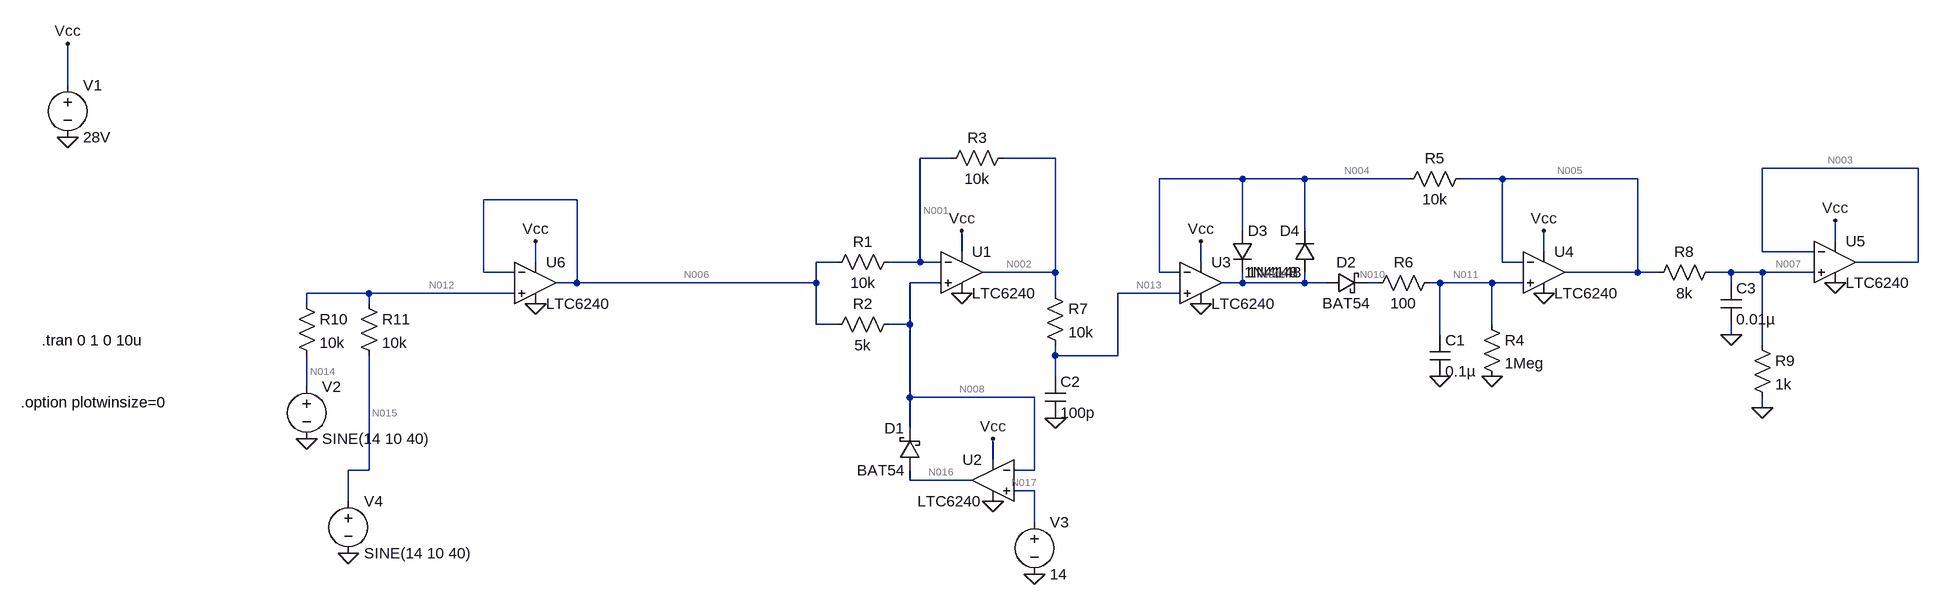
[diagram p0: schematic peak detector 2.asc]
peak detector 2.asc, the LTspice schematic file:
Version 4
SHEET 1 2260 680
WIRE -672 -160 -672 -224
WIRE 688 -48 640 -48
WIRE 848 -48 768 -48
WIRE 2176 -32 1936 -32
WIRE 1136 -16 1008 -16
WIRE 1232 -16 1136 -16
WIRE 1392 -16 1232 -16
WIRE 1536 -16 1472 -16
WIRE 1744 -16 1536 -16
WIRE 112 16 -32 16
WIRE 1136 64 1136 -16
WIRE 1232 64 1232 -16
WIRE 2048 80 2048 48
WIRE 704 96 704 64
WIRE 1600 96 1600 64
WIRE 1936 96 1936 -32
WIRE 2016 96 1936 96
WIRE 48 112 48 80
WIRE 512 112 480 112
WIRE 640 112 640 -48
WIRE 640 112 592 112
WIRE 672 112 640 112
WIRE 1072 112 1072 80
WIRE 1536 112 1536 -16
WIRE 1568 112 1536 112
WIRE 2176 112 2176 -32
WIRE 2176 112 2080 112
WIRE -32 128 -32 16
WIRE 16 128 -32 128
WIRE 848 128 848 -48
WIRE 848 128 736 128
WIRE 1008 128 1008 -16
WIRE 1040 128 1008 128
WIRE 1744 128 1744 -16
WIRE 1744 128 1632 128
WIRE 1776 128 1744 128
WIRE 1888 128 1856 128
WIRE 1936 128 1888 128
WIRE 2016 128 1936 128
WIRE 112 144 112 16
WIRE 112 144 80 144
WIRE 480 144 480 112
WIRE 480 144 112 144
WIRE 672 144 624 144
WIRE 1136 144 1136 128
WIRE 1136 144 1104 144
WIRE 1232 144 1232 128
WIRE 1232 144 1136 144
WIRE 1264 144 1232 144
WIRE 1344 144 1328 144
WIRE 1440 144 1424 144
WIRE 1520 144 1440 144
WIRE 1568 144 1520 144
WIRE 1888 144 1888 128
WIRE -208 160 -304 160
WIRE 16 160 -208 160
WIRE 848 160 848 128
WIRE 1040 160 944 160
WIRE -304 176 -304 160
WIRE -208 176 -208 160
WIRE 480 208 480 144
WIRE 512 208 480 208
WIRE 624 208 624 144
WIRE 624 208 592 208
WIRE 1520 208 1520 144
WIRE 1440 224 1440 144
WIRE 1888 224 1888 208
WIRE 1936 240 1936 128
WIRE 848 256 848 240
WIRE 944 256 944 160
WIRE 944 256 848 256
WIRE 848 288 848 256
WIRE -304 304 -304 256
WIRE 624 320 624 208
WIRE 816 320 624 320
WIRE 1936 336 1936 320
WIRE 624 368 624 320
WIRE 752 416 752 384
WIRE -208 432 -208 256
WIRE -208 432 -240 432
WIRE 816 432 816 320
WIRE 816 432 784 432
WIRE 624 448 624 432
WIRE 720 448 624 448
WIRE 816 464 784 464
WIRE -240 480 -240 432
WIRE 816 512 816 464
FLAG -672 -80 0
FLAG -672 -224 Vcc
FLAG 704 160 0
FLAG 704 64 Vcc
FLAG -304 384 0
FLAG 752 480 0
FLAG 752 384 Vcc
FLAG 816 592 0
FLAG 1072 176 0
FLAG 1072 80 Vcc
FLAG 1440 288 0
FLAG 1600 160 0
FLAG 1600 64 Vcc
FLAG 1520 288 0
FLAG 848 352 0
FLAG 1888 224 0
FLAG 2048 144 0
FLAG 2048 48 Vcc
FLAG 1936 336 0
FLAG 48 176 0
FLAG 48 80 Vcc
FLAG -240 560 0
SYMBOL voltage -672 -176 R0
WINDOW 123 0 0 Left 0
WINDOW 39 0 0 Left 0
SYMATTR InstName V1
SYMATTR Value 28V
SYMBOL OpAmps\\LTC6240 704 128 R0
SYMATTR InstName U1
SYMBOL voltage -304 288 R0
WINDOW 123 0 0 Left 0
WINDOW 39 0 0 Left 0
SYMATTR InstName V2
SYMATTR Value SINE(14 10 40)
SYMBOL res 608 96 R90
WINDOW 0 0 56 VBottom 2
WINDOW 3 32 56 VTop 2
SYMATTR InstName R1
SYMATTR Value 10k
SYMBOL res 608 192 R90
WINDOW 0 0 56 VBottom 2
WINDOW 3 32 56 VTop 2
SYMATTR InstName R2
SYMATTR Value 5k
SYMBOL res 784 -64 R90
WINDOW 0 0 56 VBottom 2
WINDOW 3 32 56 VTop 2
SYMATTR InstName R3
SYMATTR Value 10k
SYMBOL OpAmps\\LTC6240 752 448 M0
SYMATTR InstName U2
SYMBOL schottky 640 432 R180
WINDOW 0 24 64 Left 2
WINDOW 3 24 0 Left 2
SYMATTR InstName D1
SYMATTR Value BAT54
SYMATTR Description Diode
SYMATTR Type diode
SYMBOL voltage 816 496 R0
WINDOW 123 0 0 Left 0
WINDOW 39 0 0 Left 0
SYMATTR InstName V3
SYMATTR Value 14
SYMBOL OpAmps\\LTC6240 1072 144 R0
SYMATTR InstName U3
SYMBOL schottky 1264 160 R270
WINDOW 0 32 32 VTop 2
WINDOW 3 0 32 VBottom 2
SYMATTR InstName D2
SYMATTR Value BAT54
SYMATTR Description Diode
SYMATTR Type diode
SYMBOL cap 1424 224 R0
SYMATTR InstName C1
SYMATTR Value 0.1µ
SYMBOL OpAmps\\LTC6240 1600 128 R0
SYMATTR InstName U4
SYMBOL res 1504 192 R0
SYMATTR InstName R4
SYMATTR Value 1Meg
SYMBOL diode 1120 64 R0
SYMATTR InstName D3
SYMATTR Value 1N4148
SYMBOL diode 1248 128 R180
WINDOW 0 24 64 Left 2
WINDOW 3 24 0 Left 2
SYMATTR InstName D4
SYMATTR Value 1N4148
SYMBOL res 1488 -32 R90
WINDOW 0 0 56 VBottom 2
WINDOW 3 32 56 VTop 2
SYMATTR InstName R5
SYMATTR Value 10k
SYMBOL res 832 144 R0
SYMATTR InstName R7
SYMATTR Value 10k
SYMBOL cap 832 288 R0
SYMATTR InstName C2
SYMATTR Value 100p
SYMBOL res 1440 128 R90
WINDOW 0 0 56 VBottom 2
WINDOW 3 32 56 VTop 2
SYMATTR InstName R6
SYMATTR Value 100
SYMBOL res 1872 112 R90
WINDOW 0 0 56 VBottom 2
WINDOW 3 32 56 VTop 2
SYMATTR InstName R8
SYMATTR Value 8k
SYMBOL cap 1872 144 R0
SYMATTR InstName C3
SYMATTR Value 0.01µ
SYMBOL OpAmps\\LTC6240 2048 112 R0
SYMATTR InstName U5
SYMBOL res 1920 224 R0
SYMATTR InstName R9
SYMATTR Value 1k
SYMBOL OpAmps\\LTC6240 48 144 R0
SYMATTR InstName U6
SYMBOL voltage -240 464 R0
WINDOW 123 0 0 Left 0
WINDOW 39 0 0 Left 0
SYMATTR InstName V4
SYMATTR Value SINE(14 10 40)
SYMBOL res -320 160 R0
SYMATTR InstName R10
SYMATTR Value 10k
SYMBOL res -224 160 R0
SYMATTR InstName R11
SYMATTR Value 10k
TEXT -712 232 Left 2 !.tran 0 1 0 10u
TEXT -744 328 Left 2 !.option plotwinsize=0

The netlist it stands for:
* peak detector 2.asc
V1 Vcc 0 28V
* U1: LTC6240 (symbol OpAmps\LTC6240 not available, pins judged from their places): In+=N008 In-=N001 V+=Vcc V-=0 OUT=N002
V2 N014 0 SINE(14 10 40)
R1 N001 N006 10k
R2 N008 N006 5k
R3 N002 N001 10k
* U2: LTC6240 (symbol OpAmps\LTC6240 not available, pins judged from their places): In+=N017 In-=N008 V+=Vcc V-=0 OUT=N016
D1 N016 N008 BAT54
V3 N017 0 14
* U3: LTC6240 (symbol OpAmps\LTC6240 not available, pins judged from their places): In+=N013 In-=N004 V+=Vcc V-=0 OUT=N009
D2 N009 N010 BAT54
C1 N011 0 0.1µ
* U4: LTC6240 (symbol OpAmps\LTC6240 not available, pins judged from their places): In+=N011 In-=N005 V+=Vcc V-=0 OUT=N005
R4 N011 0 1Meg
D3 N004 N009 1N4148
D4 N009 N004 1N4148
R5 N005 N004 10k
R7 N002 N013 10k
C2 N013 0 100p
R6 N011 N010 100
R8 N007 N005 8k
C3 N007 0 0.01µ
* U5: LTC6240 (symbol OpAmps\LTC6240 not available, pins judged from their places): In+=N007 In-=N003 V+=Vcc V-=0 OUT=N003
R9 N007 0 1k
* U6: LTC6240 (symbol OpAmps\LTC6240 not available, pins judged from their places): In+=N012 In-=N006 V+=Vcc V-=0 OUT=N006
V4 N015 0 SINE(14 10 40)
R10 N012 N014 10k
R11 N012 N015 10k
.model D D
.lib standard.dio
.tran 0 1 0 10u
.option plotwinsize=0
.backanno
.end

* Results of the author's LTspice run, read from the files saved beside the schematic
* Operating Point, zero values left out:
*   V(vcc) = 28 V
*   V(n002) = 14 V
*   V(n008) = 14 V
*   V(n001) = 14 V
*   V(n014) = 14 V
*   V(n006) = 14 V
*   V(n016) = 14 V
*   V(n017) = 14 V
*   V(n009) = 14.13 V
*   V(n013) = 14 V
*   V(n004) = 14 V
*   V(n010) = 14 V
*   V(n011) = 14 V
*   V(n005) = 14 V
*   V(n007) = 1.556 V
*   V(n003) = 1.556 V
*   V(n012) = 14 V
*   V(n015) = 14 V
*   I(D2) = 14 µA
*   I(D3) = -2.374 nA
*   I(D4) = 40.9 nA
*   I(R1) = 3.863 pA
*   I(R3) = 3.649 pA
*   I(R4) = 14 µA
*   I(R5) = -43.27 nA
*   I(R6) = -14 µA
*   I(R8) = -1.556 mA
*   I(R9) = 1.556 mA
*   I(V1) = -40.66 mA